# Altium schematic sheet Sheet1.SchDoc: Отладочная плата
size 594 x 420 mm; Scale: 1:1; Title2str: логгера; DocumentType: Схема электрическая принципиальная; FirstReferrence: АБВГ.123456.001
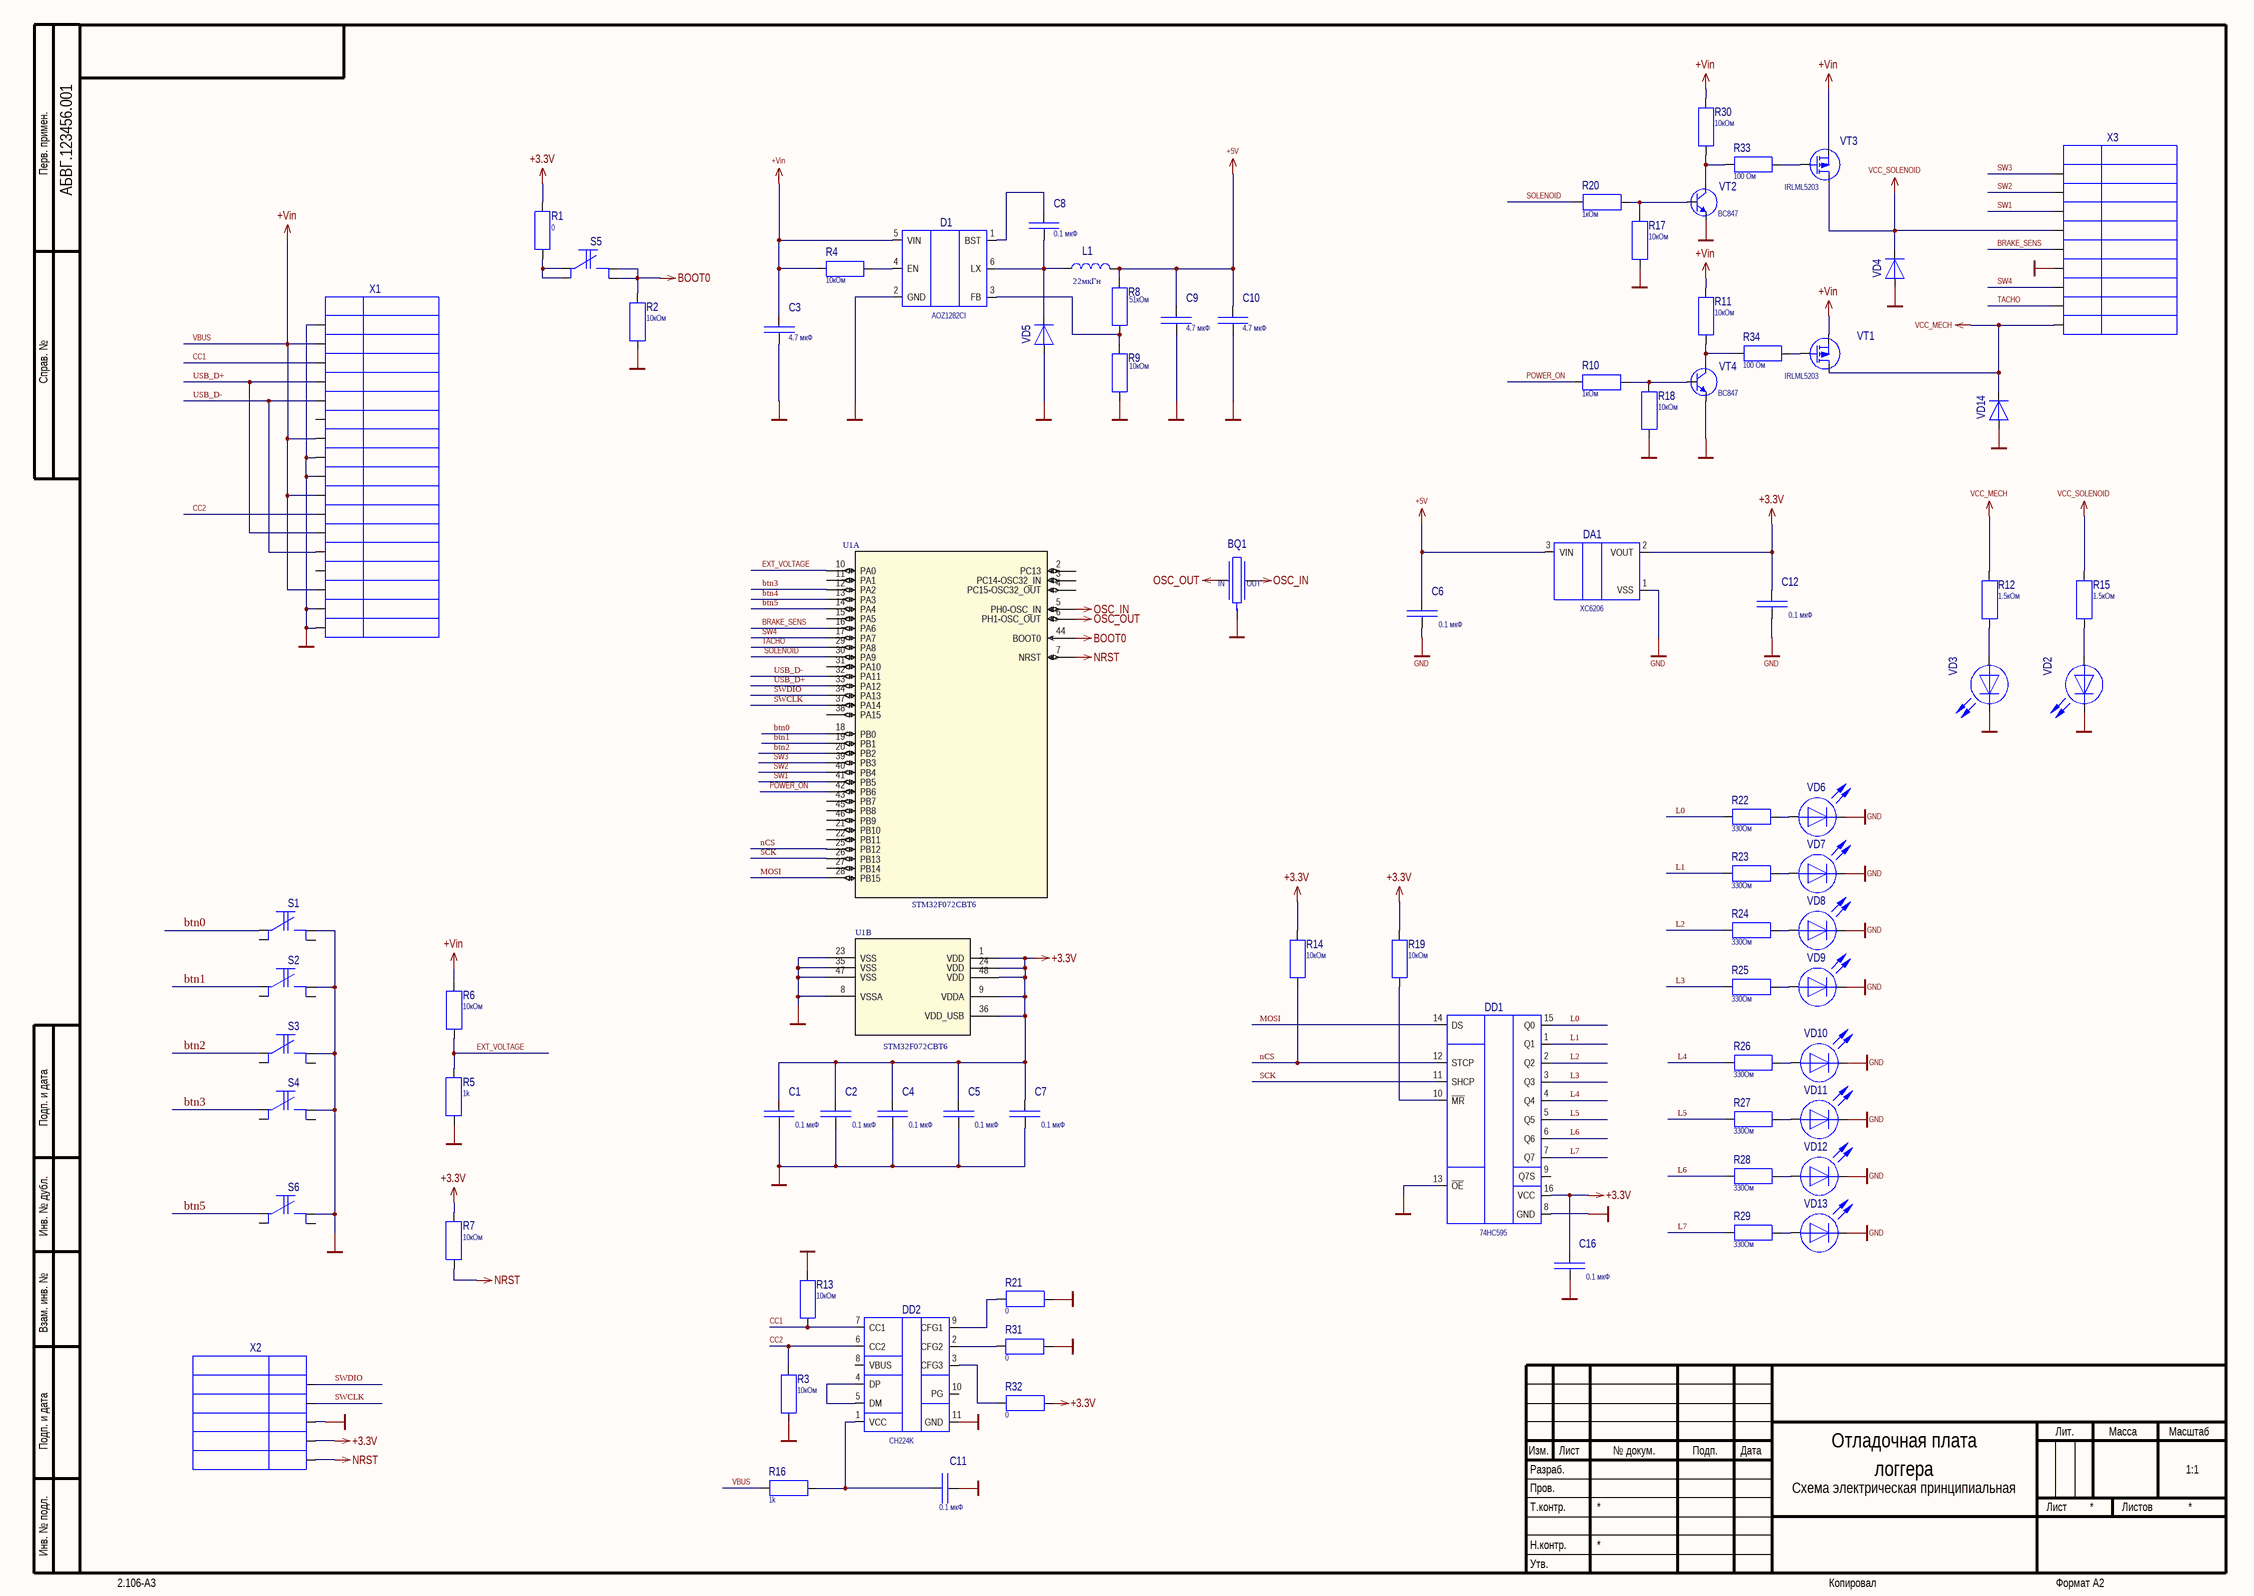
[diagram p0: Sheet1.SchDoc]

## Parts
BQ1  CSTCE8M00G15C99  [CRYSTAL-SMD_3P-L3.2-W1.3-P1.2-BL-1]  (value not drawn)
C1  value 0.1 мкФ  [C0805]  (hidden comment: C_2)
C2  value 0.1 мкФ  [C0805]  (hidden comment: C_2)
C3  value 4.7 мкФ  [C0805]  (hidden comment: C_2)
C4  value 0.1 мкФ  [C0805]  (hidden comment: C_2)
C5  value 0.1 мкФ  [C0805]  (hidden comment: C_2)
C6  value 0.1 мкФ  [C0805]  (hidden comment: C_2)
C7  value 0.1 мкФ  [C0805]  (hidden comment: C_2)
C8  value 0.1 мкФ  [C0805]  (hidden comment: C_2)
C9  value 4.7 мкФ  [C0805]  (hidden comment: C_2)
C10  value 4.7 мкФ  [C0805]  (hidden comment: C_2)
C11  value 0.1 мкФ  [C0805]  (hidden comment: C_2)
C12  value 0.1 мкФ  [C0805]  (hidden comment: C_2)
C16  value 0.1 мкФ  [C0805]  (hidden comment: C_2)
D1  AOZ1282CI  [SOT23-6_M]
DA1  XC6206  [SOT23_S]
DD1  74HC595  [SO-16_M]
DD2  CH224K  [ESSOP-10_L4.9-W3.9-P1.0-LS6.0-TL-EP]
L1  value 22мкГн  [4.5X3.0]  (hidden comment: L_1)
R1  value 0  [r0805]  (hidden comment: R_1)  (no BOM)
R2  value 10кОм  [r0805]  (hidden comment: R_1)
R3  value 10кОм  [r0805]  (hidden comment: R_1)
R4  value 10кОм  [R0805]  (hidden comment: R_1)
R5  value 1k  [r0805]  (hidden comment: R_1)  (no BOM)
R6  value 10кОм  [r0805]  (hidden comment: R_1)
R7  value 10кОм  [r0805]  (hidden comment: R_1)
R8  value 51кОм  [R0805]  (hidden comment: R_1)
R9  value 10кОм  [R0805]  (hidden comment: R_1)
R10  value 1кОм  [r0805]  (hidden comment: R_1)
R11  value 10кОм  [r0805]  (hidden comment: R_1)
R12  value 1.5кОм  [R0805]  (hidden comment: R_1)
R13  value 10кОм  [r0805]  (hidden comment: R_1)
R14  value 10кОм  [r0805]  (hidden comment: R_1)
R15  value 1.5кОм  [R0805]  (hidden comment: R_1)
R16  value 1k  [r0805]  (hidden comment: R_1)  (no BOM)
R17  value 10кОм  [r0805]  (hidden comment: R_1)
R18  value 10кОм  [r0805]  (hidden comment: R_1)
R19  value 10кОм  [r0805]  (hidden comment: R_1)
R20  value 1кОм  [r0805]  (hidden comment: R_1)
R21  value 0  [r0805]  (hidden comment: R_1)  (no BOM)
R22  value 330Ом  [R0805]  (hidden comment: R_1)
R23  value 330Ом  [R0805]  (hidden comment: R_1)
R24  value 330Ом  [R0805]  (hidden comment: R_1)
R25  value 330Ом  [R0805]  (hidden comment: R_1)
R26  value 330Ом  [R0805]  (hidden comment: R_1)
R27  value 330Ом  [R0805]  (hidden comment: R_1)
R28  value 330Ом  [R0805]  (hidden comment: R_1)
R29  value 330Ом  [R0805]  (hidden comment: R_1)
R30  value 10кОм  [r0805]  (hidden comment: R_1)
R31  value 0  [r0805]  (hidden comment: R_1)  (no BOM)
R32  value 0  [r0805]  (hidden comment: R_1)  (no BOM)
R33  value 100 Ом  [r0805]  (hidden comment: R_1)
R34  value 100 Ом  [r0805]  (hidden comment: R_1)
S1  SW_BOT  [SW-PB]  (value not drawn)
S2  SW_BOT  [SW-PB]  (value not drawn)
S3  SW_BOT  [SW-PB]  (value not drawn)
S4  SW_BOT  [SW-PB]  (value not drawn)
S5  SW_BOT  [SW-PB]  (value not drawn)
S6  SW_BOT  [SW-PB]  (value not drawn)
U1  STM32F072CBT6  [TQFP48_M]  (parts A,B of 2)
VD2  LED  [L0805]  (value not drawn)
VD3  LED  [L0805]  (value not drawn)
VD4  MBR0540T1G  [SOD123]  (value not drawn)
VD5  MBR0540T1G  [SOD123]  (value not drawn)
VD6  LED  [L0805]  (value not drawn)
VD7  LED  [L0805]  (value not drawn)
VD8  LED  [L0805]  (value not drawn)
VD9  LED  [L0805]  (value not drawn)
VD10  LED  [L0805]  (value not drawn)
VD11  LED  [L0805]  (value not drawn)
VD12  LED  [L0805]  (value not drawn)
VD13  LED  [L0805]  (value not drawn)
VD14  MBR0540T1G  [SOD123]  (value not drawn)
VT1  IRLML5203  [SOT23_M]
VT2  BC847  [SOT23_S]
VT3  IRLML5203  [SOT23_M]
VT4  BC847  [SOT23_S]
X1  USBC-16PIN-VERTICAL  [USB-C-16-pin-vertical]  (value not drawn)
X2  PLS5  [HDR1X5]  (value not drawn)
X3  PLS9  [PH-9A_P]  (value not drawn)

## Nets
+3.3V: C1.1 C2.1 C4.1 C5.1 C7.1 C12.1 C16.1 DA1.2(VOUT) DD1.16(VCC) R1.2 R7.2 R14.1 R19.1 R32.1 U1.1(VDD) U1.9(VDDA) U1.24(VDD) U1.36(VDD_USB) U1.48(VDD) X2.4
+5V: C6.1 C9.1 C10.1 DA1.3(VIN) L1.2 R8.1
BOOT0: R2.1 S5.2 S5.3 U1.44(BOOT0)
GND: BQ1.2 C1.2 C2.2 C3.2 C4.2 C5.2 C6.2 C7.2 C9.2 C10.2 C11.2 C12.2 C16.2 D1.2(GND) DA1.1(VSS) DD1.8(GND) DD1.13(~{OE}) DD2.11(GND) R2.2 R3.2 R5.1 R9.2 R13.1 R17.2 R18.2 R21.1 R31.2 S1.2 S2.2 S3.2 S4.2 S6.2 U1.8(VSSA) U1.23(VSS) U1.35(VSS) U1.47(VSS) VD2.2 VD3.2 VD4.1 VD5.1 VD6.2 VD7.2 VD8.2 VD9.2 VD10.2 VD11.2 VD12.2 VD13.2 VD14.1 VT2.2(E) VT4.2(E) X1.1 X1.A1 X1.A12 X1.B1 X1.B12 X2.3 X3.6
NRST: R7.1 U1.7(NRST) X2.5
OSC_IN: BQ1.3 U1.5(PH0-OSC_IN)
OSC_OUT: BQ1.1 U1.6(PH1-OSC_OUT)
VBUS: C3.1 D1.5(VIN) R4.1 R6.1 R11.1 R16.2 R30.1 VT1.2(S) VT3.2(S) X1.A4 X1.A9 X1.B4 X1.B9  [also labelled +Vin]
VCC_MECH: R12.1 VD14.2 VT1.3(D) X3.9
VCC_SOLENOID: R15.1 VD4.2 VT3.3(D) X3.4
BRAKE_SENS: U1.16(PA6) X3.5
btn0: S1.1 U1.18(PB0)
btn1: S2.1 U1.19(PB1)
btn2: S3.1 U1.20(PB2)
btn3: S4.1 U1.12(PA2)
btn4: U1.13(PA3)
btn5: S6.1 U1.14(PA4)
CC1: DD2.7(CC1) R13.2 X1.A5
CC2: DD2.6(CC2) R3.1 X1.B5
EXT_VOLTAGE: R5.2 R6.2 U1.10(PA0)
L0: DD1.15(Q0) R22.2
L1: DD1.1(Q1) R23.2
L2: DD1.2(Q2) R24.2
L3: DD1.3(Q3) R25.2
L4: DD1.4(Q4) R26.2
L5: DD1.5(Q5) R27.2
L6: DD1.6(Q6) R28.2
L7: DD1.7(Q7) R29.2
MOSI: DD1.14(DS) U1.28(PB15)
nCS: DD1.12(STCP) R14.2 U1.25(PB12)
POWER_ON: R10.1 U1.42(PB6)
SCK: DD1.11(SHCP) U1.26(PB13)
SOLENOID: R20.2 U1.30(PA9)
SW1: U1.41(PB5) X3.3
SW2: U1.40(PB4) X3.2
SW3: U1.39(PB3) X3.1
SW4: U1.17(PA7) X3.7
SWCLK: U1.37(PA14) X2.2
SWDIO: U1.34(PA13) X2.1
TACHO: U1.29(PA8) X3.8
USB_D+: U1.33(PA12) X1.A6 X1.B6
USB_D-: U1.32(PA11) X1.A7 X1.B7
NetC8_1: C8.1 D1.1(BST)
NetC8_2: C8.2 D1.6(LX) L1.1 VD5.2
NetC11_1: C11.1 DD2.1(VCC) R16.1
NetD1_3: D1.3(FB) R8.2 R9.1
NetD1_4: D1.4(EN) R4.2
NetDD1_10: DD1.10(~{MR}) R19.2
NetDD2_2: DD2.2(CFG2) R31.1
NetDD2_3: DD2.3(CFG3) R32.2
NetDD2_4: DD2.4(DP) DD2.5(DM)
NetDD2_9: DD2.9(CFG1) R21.2
NetR1_1: R1.1 S5.1 S5.4
NetR10_2: R10.2 R18.1 VT4.1(B)
NetR11_2: R11.2 R34.2 VT4.3(C)
NetR12_2: R12.2 VD3.1
NetR15_2: R15.2 VD2.1
NetR17_1: R17.1 R20.1 VT2.1(B)
NetR22_1: R22.1 VD6.1
NetR23_1: R23.1 VD7.1
NetR24_1: R24.1 VD8.1
NetR25_1: R25.1 VD9.1
NetR26_1: R26.1 VD10.1
NetR27_1: R27.1 VD11.1
NetR28_1: R28.1 VD12.1
NetR29_1: R29.1 VD13.1
NetR30_2: R30.2 R33.2 VT2.3(C)
NetR33_1: R33.1 VT3.1(G)
NetR34_1: R34.1 VT1.1(G)

Not connected (* = marked no-connect by the designer): DD1 9(Q7S); DD2 8(VBUS) 10(PG); S1 3 4; S2 3 4; S3 3 4; S4 3 4; S6 3 4; U1 2(PC13) 3(PC14-OSC32_IN) 4(PC15-OSC32_OUT) 11(PA1) 15(PA5) 21(PB10) 22(PB11) 27(PB14) 31(PA10) 38(PA15) 43(PB7) 45(PB8) 46(PB9); X1 A8 B8

## Notes on the sheet
- Перв. примен.
- Справ. №
- Подп. и дата
- Инв. № дубл.
- Взам. инв. №
- Разраб.
- Изм.
- Лист
- № докум.
- Подп.
- Дата
- Лит.
- Масса
- Масштаб
- Пров.
- Т.контр.
- Листов
- Инв. № подл.
- Утв.
- Н.контр.
- 2.106-A3
- Копировал
- Формат А2
- (in symbol CSTCE8M00G15C99) IN; OUT

## Library data of the parts
BQ1 = CSTCE8M00G15C99: Manufacturer: ф. Murata; Pack: SMB(DO-214AA); BCDId: *; ManufacturerPartNumber: CSTCE8M00G15C99; TU/GOST: *; Type: Кварцевый резонатор; ValueBOM: *
C1 C2 C4-C8 C11 C12 C16 = C_2: Name: X7R, 0805; Power/Voltage: 50В; Tolerance: 5%; Type: Конденсатор; BCDId: *; ManufacturerPartNumber: *; Rem: *; TKE/TCK: *; TU/GOST: *; ValueBOM: *
C3 C9 C10 = C_2: Name: X7R, 0805; Power/Voltage: 25В; Tolerance: 5%; Type: Конденсатор; BCDId: *; ManufacturerPartNumber: *; Rem: *; TKE/TCK: *; TU/GOST: *; ValueBOM: *
D1 = AOZ1282CI: Manufacturer: ф. Alpha & Omega; Type: Микросхема; BCDId: *; ManufacturerPartNumber: AOZ1282CI; TU/GOST: *; ValueBOM: *; Name: https://www.chipdip.ru/product0/8001834236
DA1 = XC6206: Manufacturer: ф. Torex; BCDId: *; ManufacturerPartNumber: XC6206; TU/GOST: *; ValueBOM: *
DD1 = 74HC595: Manufacturer: ф. Nexperia B.V.; ManufacturerPartNumber: 74HC595D; BCDId: *; TU/GOST: *; Type: Микросхема; ValueBOM: *
DD2 = CH224K: Manufacturer: ф. WCH; BCDId: *; ManufacturerPartNumber: CH224K; TU/GOST: *; Type: Микросхема; ValueBOM: *
L1 = L_1: Manufacturer: ф. CODACA; Name: SP43-220K; Tolerance: 10%; Type: Катушка индуктивности; BCDId: *; ManufacturerPartNumber: *; Power/Voltage: *; Rem: *; TKE/TCK: *; TU/GOST: *; ValueBOM: *
R1-R34 = R_1: Name: 0805; Tolerance: 5%; BCDId: *; Manufacturer: *; ManufacturerPartNumber: *; Power/Voltage: *; Rem: *; TKE/TCK: *; TU/GOST: *; Type: Резистор; ValueBOM: *
S1-S6 = SW_BOT: ManufacturerPartNumber: Кнопка тактовая 4.5x6.5мм; BCDId: *; TU/GOST: *; Type: Тактовая кнопка; ValueBOM: *
U1 = STM32L052CL3: No Description Available; Vendor: STMicroelectronics; Manufacturer_Part_Number: stm32l052cl3; Copyright: Copyright (C) 2016 Accelerated Designs. All rights reserved; RefDes: RefDes; Type: DEV; ManufacturerPartNumber: STM32F072CBT6
VD2 VD3 = LED: ManufacturerPartNumber: KPT-2012SGC (Красный)  *любой 0805; Type: Светодиод; BCDId: *; Manufacturer: *; TU/GOST: *; ValueBOM: *; Pack: SMD 0805
VD4 VD5 VD14 = MBR0540T1G: Manufacturer: ф.  ON Semi; Type: Диод; Pack: SOT23; BCDId: *; ManufacturerPartNumber: MBR0540T1G; TU/GOST: *; ValueBOM: *
VD6-VD13 = LED: ManufacturerPartNumber: KPT-2012SGC (Зеленый)  *любой 0805; Type: Светодиод; BCDId: *; Manufacturer: *; TU/GOST: *; ValueBOM: *; Pack: SMD 0805
VT1 VT3 = IRLML5203: Manufacturer: ф. IR; Type: Транзистор; BCDId: *; ManufacturerPartNumber: IRLML5203; TU/GOST: *; ValueBOM: *
VT2 VT4 = BC847: Manufacturer: ф. NXP; Type: Транзистор; BCDId: *; ManufacturerPartNumber: BC847; TU/GOST: *; ValueBOM: *
X1 = USBC-16PIN-VERTICAL: Manufacturer: ф. Ningbo Zhenqin Electronic; ManufacturerPartNumber: PLS11; BCDId: *; TU/GOST: *; Type: Разъём; ValueBOM: *
X2 = PLS5: Manufacturer: ф. Ningbo Zhenqin Electronic; BCDId: *; ManufacturerPartNumber: PLS5; TU/GOST: *; Type: Разъём; ValueBOM: *
X3 = PLS9: Manufacturer: ф. Ningbo Zhenqin Electronic; ManufacturerPartNumber: PH2.0-9A_P; BCDId: *; TU/GOST: *; Type: Разъём; ValueBOM: *